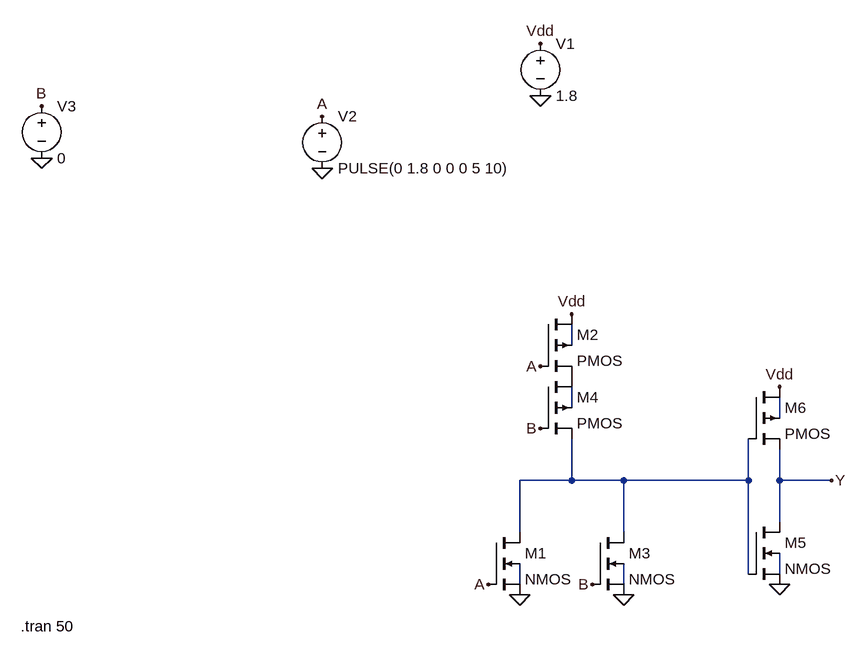
[diagram p0: schematic OR.asc]
OR.asc, the LTspice schematic file:
Version 4
SHEET 1 1536 680
WIRE 512 112 512 80
WIRE 512 208 512 176
WIRE 832 224 832 192
WIRE 512 320 512 256
WIRE 512 320 432 320
WIRE 592 320 512 320
WIRE 784 320 784 256
WIRE 784 320 592 320
WIRE 832 320 832 272
WIRE 912 320 832 320
WIRE 832 384 832 320
WIRE 432 400 432 320
WIRE 592 400 592 320
WIRE 784 464 784 320
WIRE 832 464 832 432
WIRE 432 480 432 448
WIRE 592 480 592 448
FLAG 464 -352 Vdd
FLAG 464 -272 0
FLAG 128 -240 A
FLAG 128 -160 0
FLAG 592 496 0
FLAG 512 64 Vdd
FLAG -304 -256 B
FLAG -304 -176 0
FLAG 464 144 A
FLAG 384 480 A
FLAG 464 240 B
FLAG 544 480 B
FLAG 432 496 0
FLAG 832 480 0
FLAG 832 176 Vdd
FLAG 912 320 Y
SYMBOL nmos4 384 400 R0
SYMATTR InstName M1
SYMATTR Value2 l=0.13u w=0.13u
SYMBOL pmos4 464 64 R0
SYMATTR InstName M2
SYMATTR Value2 l=0.13u w=0.13u
SYMBOL voltage 464 -368 R0
WINDOW 123 0 0 Left 0
WINDOW 39 0 0 Left 0
SYMATTR InstName V1
SYMATTR Value 1.8
SYMBOL voltage 128 -256 R0
WINDOW 123 0 0 Left 0
WINDOW 39 0 0 Left 0
SYMATTR InstName V2
SYMATTR Value PULSE(0 1.8 0 0 0 5 10)
SYMBOL nmos4 544 400 R0
SYMATTR InstName M3
SYMATTR Value2 l=0.13u w=0.13u
SYMBOL pmos4 464 160 R0
SYMATTR InstName M4
SYMATTR Value2 l=0.13u w=0.13u
SYMBOL voltage -304 -272 R0
WINDOW 123 0 0 Left 0
WINDOW 39 0 0 Left 0
SYMATTR InstName V3
SYMATTR Value 0
SYMBOL nmos4 784 384 R0
SYMATTR InstName M5
SYMATTR Value2 l=0.13u w=0.13u
SYMBOL pmos4 784 176 R0
SYMATTR InstName M6
SYMATTR Value2 l=0.13u w=0.13u
TEXT -336 544 Left 2 !.tran 50

The netlist it stands for:
* OR.asc
M1 N004 A 0 N006 NMOS l=0.13u w=0.13u
M2 Vdd A P001 N001 PMOS l=0.13u w=0.13u
V1 Vdd 0 1.8
V2 A 0 PULSE(0 1.8 0 0 0 5 10)
M3 N004 B 0 N007 NMOS l=0.13u w=0.13u
M4 P001 B N004 N002 PMOS l=0.13u w=0.13u
V3 B 0 0
M5 Y N004 0 N005 NMOS l=0.13u w=0.13u
M6 Vdd N004 Y N003 PMOS l=0.13u w=0.13u
.model NMOS NMOS
.model PMOS PMOS
.lib standard.mos
.tran 50
.backanno
.end